# Altium schematic sheet DOut_Relay.SchDoc
size A4; SheetNumber: 15; SheetTotal: 16
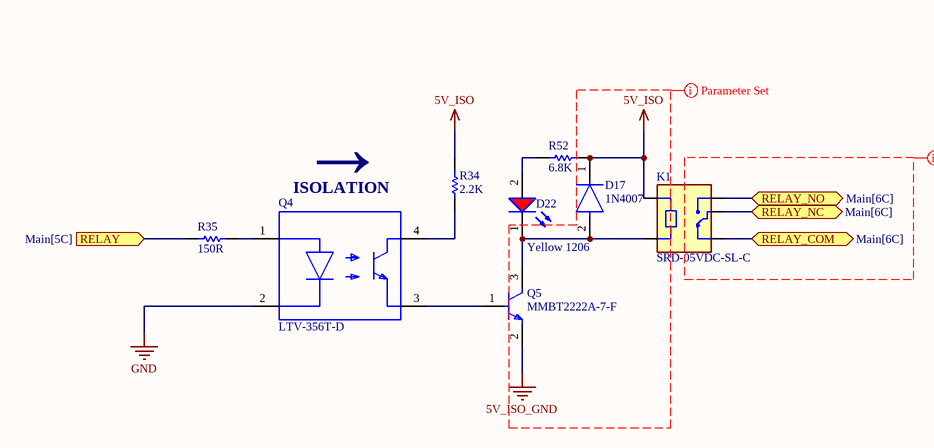
[diagram p0: DOut_Relay.SchDoc]

## Parts
D17  1N4007  [FP-1N4007_SMD-IPC_C]
D22  Yellow 1206  [WL-SMCW_1206_150120xx75000]
K1  SRD-05VDC-SL-C  [RELAY_SRD-05VDC-SL-C]
Q4  LTV-356T-D  [FP-LTV-356T-D-MFG]
Q5  MMBT2222A-7-F  [FP-SOT23-IPC_A]
R34  2.2K  [RESC1608X55X30LL15T15]
R35  150R  [RESC1608X55X30ML20T20]
R52  6.8K  [RESC1608X55X30LL15T15]

## Ports
RELAY (in, see Main[5C]), RELAY_COM (bidir, see Main[6C]), RELAY_NC (bidir, see Main[6C]), RELAY_NO (bidir, see Main[6C])

## Nets
5V_ISO: D17.1(C) K1.A1 R34.1 R52.2
5V_ISO_GND: Q5.2(E)
GND: Q4.2(C)
RELAY: R35.1 ; port RELAY
RELAY_COM: K1.NC ; port RELAY_COM
RELAY_NC: K1.COM ; port RELAY_NC
RELAY_NO: K1.NO ; port RELAY_NO
NetD17_2: D17.2(A) D22.1(K) K1.A2 Q5.3(C)
NetD22_2: D22.2(A) R52.1
NetQ4_1: Q4.1(A) R35.2
NetQ4_3: Q4.3(E) Q5.1(B)
NetQ4_4: Q4.4(C) R34.2

## Layout directives
net class RELAY_COIL: 5V_ISO, 5V_ISO_GND
net class RELAY: (no net found under the mark)

## Notes on the sheet
- (near Q4) ←
- (near Q4) ISOLATION

## Library data of the parts
D17 = CMP-12389-000001-1: Rectifier, 1Kv, 1A, Do-214Ac Rohs Compliant: Yes
D22 = CMP-1426-00017-3: Led, Red, 630 Nm, 1.9 V, 30 Ma, 60 Mcd Rohs Compliant: Yes; Forward Current: 100mA; Max Reverse Voltage (DC): 5V; Lens Style: Clear, Rectangular; Viewing Angle: 140°; Luminous Intensity: 60mcd; Peak Wavelength: 645nm; Forward Voltage: 1.9V; Test Current: 20mA; Dominant Wavelength: 630nm; Case Code (Imperial): 1206; Length: 3.2mm; Mount: Surface Mount; Case Code (Metric): 3216; Case/Package: 1206; Min Operating Temperature: -40°C; Width: 1.6mm; Color: Red; Height: 680µm; REACH SVHC: Unknown; Max Operating Temperature: 85°C; Wavelength: 630nm; RoHS: Compliant; Packaging: Tape and Reel
K1 = SRD-05VDC-SL-C: 5V Trigger Relay Module For Arduino And Raspberry Pi 5V Trigger Relay Module For Arduino And Raspberry Pi; MF: Songle Relay; Check_prices: https://www.snapeda.com/parts/SRD-05VDC-SL-C/Songle+Relay/view-part/?ref=eda; Value: *; Availability: Not in stock; Price: None; Package: NON STANDARD-5 Songle Relay; MP: SRD-05VDC-SL-C; SnapEDA_Link: https://www.snapeda.com/parts/SRD-05VDC-SL-C/Songle+Relay/view-part/?ref=snap
Q4 = CMP-22018-000003-1: OPTOCPL 1 CH TRAN OUT SMT; Manufacturer: Lite-On; Collector Emitter Voltage: 80V; Standoff Height: 0mm; Power Dissipation: 170mW; Forward Current: 20mA; Emiiter Collector Voltage: 6V; Isolation Voltage: 3750Vrms; Max Junction Temp: +125°C; Forward Voltage: 1.2V; Max Current Transfer Ratio: 600%; Min Current Transfer Ratio: 300%; RoHS: TRUE; Device Class L3: unset; Package: LTV-356T-D; Temperature Range High: +110°C; Temperature Range Low: -55°C; Device Class L2: Optocouplers; Reverse Voltage: 6V; Temperature: -55°C to +110°C; Manufacturer Part Number: LTV-356T-D; Category: Trans; ComponentLink2URL: https://ve.mouser.com/datasheet/2/239/LTV-356T%20series%20201610-1139805.pdf; Octopart: https://octopart.com/ltv-356t-d-lite-on-11764243; Automotive: No; Digikey Description: OPTOCPL 1 CH TRAN OUT SMT; ComponentLink2Description: Datasheet; Height: 2.4mm; Device Class L1: Optoelectronics; Lead Free: Yes
Q5 = CMP-1693-00003-4: TRANS NPN 40V 0.6A SMD SOT23-3; Number of Elements: 1; Frequency: 300MHz; Max Collector Current: 600mA; Collector Base Voltage (VCBO): 75V; Current: 1A; Element Configuration: Single; Power Dissipation: 350mW; hFE Min: 100; Collector Emitter Saturation Voltage: 1V; Max Power Dissipation: 300mW; Emitter Base Voltage (VEBO): 6V; Voltage: 40V; Collector Emitter Breakdown Voltage: 40V; Width: 1.4mm; Polarity: NPN; Termination: SMD/SMT; Max Operating Temperature: 150°C; Transition Frequency: 300MHz; Contact Plating: Tin; Mount: Surface Mount; Max Frequency: 300MHz; Case/Package: SOT-23; Gain Bandwidth Product: 300MHz; Lead Free: Lead Free; Collector Emitter Voltage (VCEO): 40V; Radiation Hardening: No; Voltage Rating (DC): 40V; Height: 1mm; Max Breakdown Voltage: 40V; Packaging: Tape and Reel; Length: 3.05mm; Min Operating Temperature: -55°C; Weight: 0.000282oz; Current Rating: 600mA; REACH SVHC: No SVHC; Package Quantity: 3000; Continuous Collector Current: 600mA; Number of Pins: 3
R34 = CMP-2000-00336-1: Part Number: ERJ3EKF2201V; Manufacturer: Panasonic
R35 = CMP-2000-00914-1: Part Number: ERA3AEB151V; Manufacturer: Panasonic
R52 = CMP-2000-00803-1: Part Number: ERJ-3GEYJ512V; Manufacturer: Panasonic